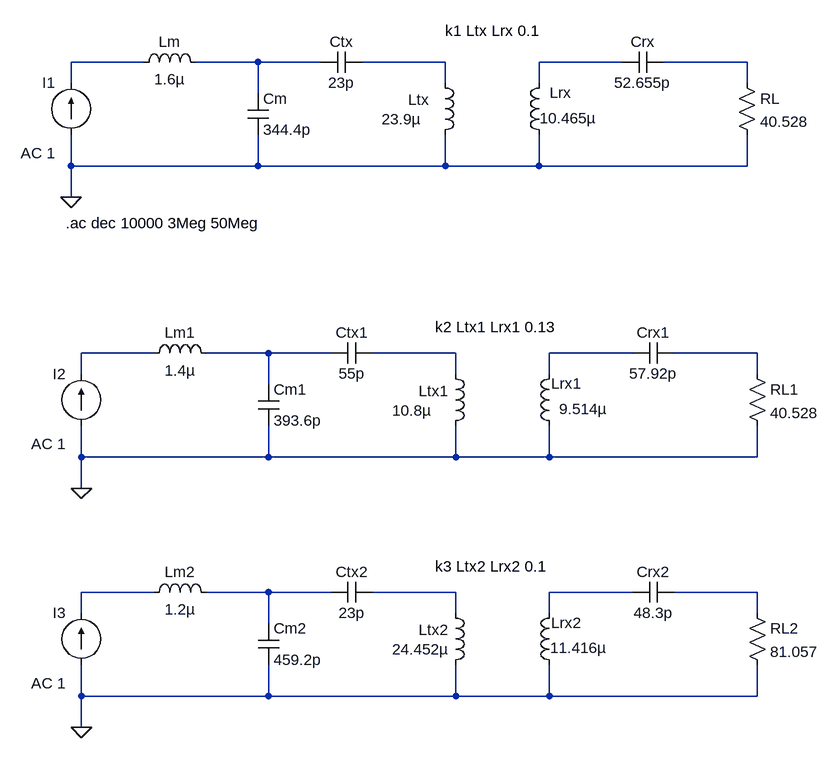
[diagram p0: schematic AC_LCCL_S.asc]
AC_LCCL_S.asc, the LTspice schematic file:
Version 4.1
SHEET 1 1048 1156
WIRE 0 112 -112 112
WIRE 176 112 80 112
WIRE 272 112 176 112
WIRE 464 112 336 112
WIRE 736 112 608 112
WIRE 928 112 800 112
WIRE -112 144 -112 112
WIRE 464 144 464 112
WIRE 608 144 608 112
WIRE 928 144 928 112
WIRE 176 160 176 112
WIRE -112 272 -112 224
WIRE 176 272 176 224
WIRE 176 272 -112 272
WIRE 464 272 464 224
WIRE 464 272 176 272
WIRE 608 272 608 224
WIRE 608 272 464 272
WIRE 928 272 928 224
WIRE 928 272 608 272
WIRE -112 320 -112 272
WIRE 16 560 -96 560
WIRE 192 560 96 560
WIRE 288 560 192 560
WIRE 480 560 352 560
WIRE 752 560 624 560
WIRE 944 560 816 560
WIRE -96 592 -96 560
WIRE 480 592 480 560
WIRE 624 592 624 560
WIRE 944 592 944 560
WIRE 192 608 192 560
WIRE -96 720 -96 672
WIRE 192 720 192 672
WIRE 192 720 -96 720
WIRE 480 720 480 672
WIRE 480 720 192 720
WIRE 624 720 624 672
WIRE 624 720 480 720
WIRE 944 720 944 672
WIRE 944 720 624 720
WIRE -96 768 -96 720
WIRE 16 928 -96 928
WIRE 192 928 96 928
WIRE 288 928 192 928
WIRE 480 928 352 928
WIRE 752 928 624 928
WIRE 944 928 816 928
WIRE -96 960 -96 928
WIRE 480 960 480 928
WIRE 624 960 624 928
WIRE 944 960 944 928
WIRE 192 976 192 928
WIRE -96 1088 -96 1040
WIRE 192 1088 192 1040
WIRE 192 1088 -96 1088
WIRE 480 1088 480 1040
WIRE 480 1088 192 1088
WIRE 624 1088 624 1040
WIRE 624 1088 480 1088
WIRE 944 1088 944 1040
WIRE 944 1088 624 1088
WIRE -96 1136 -96 1088
FLAG -112 320 0
FLAG -96 768 0
FLAG -96 1136 0
SYMBOL ind -16 128 R270
WINDOW 0 32 56 VTop 2
WINDOW 3 5 56 VBottom 2
SYMATTR InstName Lm
SYMATTR Value 1.6µ
SYMBOL cap 160 160 R0
SYMATTR InstName Cm
SYMATTR Value 344.4p
SYMBOL cap 336 96 R90
WINDOW 0 0 32 VBottom 2
WINDOW 3 32 32 VTop 2
SYMATTR InstName Ctx
SYMATTR Value 23p
SYMBOL ind 448 128 R0
WINDOW 0 -41 42 Left 2
WINDOW 3 -82 72 Left 2
SYMATTR InstName Ltx
SYMATTR Value 23.9µ
SYMATTR Type ind
SYMBOL ind 624 240 R180
WINDOW 0 -34 81 Left 2
WINDOW 3 -73 42 Left 2
SYMATTR InstName Lrx
SYMATTR Value 10.465µ
SYMATTR Type ind
SYMBOL cap 800 96 R90
WINDOW 0 0 32 VBottom 2
WINDOW 3 32 32 VTop 2
SYMATTR InstName Crx
SYMATTR Value 52.655p
SYMBOL res 912 128 R0
SYMATTR InstName RL
SYMATTR Value 40.528
SYMBOL current -112 224 R180
WINDOW 0 24 80 Left 2
WINDOW 3 24 0 Left 2
WINDOW 123 24 -28 Left 2
WINDOW 39 0 0 Left 0
SYMATTR InstName I1
SYMATTR Value ""
SYMATTR Value2 AC 1
SYMBOL ind 0 576 R270
WINDOW 0 32 56 VTop 2
WINDOW 3 5 56 VBottom 2
SYMATTR InstName Lm1
SYMATTR Value 1.4µ
SYMBOL cap 176 608 R0
SYMATTR InstName Cm1
SYMATTR Value 393.6p
SYMBOL cap 352 544 R90
WINDOW 0 0 32 VBottom 2
WINDOW 3 32 32 VTop 2
SYMATTR InstName Ctx1
SYMATTR Value 55p
SYMBOL ind 464 576 R0
WINDOW 0 -41 42 Left 2
WINDOW 3 -82 72 Left 2
SYMATTR InstName Ltx1
SYMATTR Value 10.8µ
SYMATTR Type ind
SYMBOL ind 640 688 R180
WINDOW 0 -34 81 Left 2
WINDOW 3 -73 42 Left 2
SYMATTR InstName Lrx1
SYMATTR Value 9.514µ
SYMATTR Type ind
SYMBOL cap 816 544 R90
WINDOW 0 0 32 VBottom 2
WINDOW 3 32 32 VTop 2
SYMATTR InstName Crx1
SYMATTR Value 57.92p
SYMBOL res 928 576 R0
SYMATTR InstName RL1
SYMATTR Value 40.528
SYMBOL current -96 672 R180
WINDOW 0 24 80 Left 2
WINDOW 3 24 0 Left 2
WINDOW 123 24 -28 Left 2
WINDOW 39 0 0 Left 0
SYMATTR InstName I2
SYMATTR Value ""
SYMATTR Value2 AC 1
SYMBOL ind 0 944 R270
WINDOW 0 32 56 VTop 2
WINDOW 3 5 56 VBottom 2
SYMATTR InstName Lm2
SYMATTR Value 1.2µ
SYMBOL cap 176 976 R0
SYMATTR InstName Cm2
SYMATTR Value 459.2p
SYMBOL cap 352 912 R90
WINDOW 0 0 32 VBottom 2
WINDOW 3 32 32 VTop 2
SYMATTR InstName Ctx2
SYMATTR Value 23p
SYMBOL ind 464 944 R0
WINDOW 0 -41 42 Left 2
WINDOW 3 -82 72 Left 2
SYMATTR InstName Ltx2
SYMATTR Value 24.452µ
SYMATTR Type ind
SYMBOL ind 640 1056 R180
WINDOW 0 -34 81 Left 2
WINDOW 3 -73 42 Left 2
SYMATTR InstName Lrx2
SYMATTR Value 11.416µ
SYMATTR Type ind
SYMBOL cap 816 912 R90
WINDOW 0 0 32 VBottom 2
WINDOW 3 32 32 VTop 2
SYMATTR InstName Crx2
SYMATTR Value 48.3p
SYMBOL res 928 944 R0
SYMATTR InstName RL2
SYMATTR Value 81.057
SYMBOL current -96 1040 R180
WINDOW 0 24 80 Left 2
WINDOW 3 24 0 Left 2
WINDOW 123 24 -28 Left 2
WINDOW 39 0 0 Left 0
SYMATTR InstName I3
SYMATTR Value ""
SYMATTR Value2 AC 1
TEXT 464 64 Left 2 !k1 Ltx Lrx 0.1
TEXT -120 360 Left 2 !.ac dec 10000 3Meg 50Meg
TEXT 448 520 Left 2 !k2 Ltx1 Lrx1 0.13
TEXT 448 888 Left 2 !k3 Ltx2 Lrx2 0.1

The netlist it stands for:
* AC_LCCL_S.asc
Lm N001 N002 1.6µ
Cm N002 0 344.4p
Ctx N003 N002 23p
Ltx N003 0 23.9µ
Lrx 0 N004 10.465µ
Crx N005 N004 52.655p
RL N005 0 40.528
I1 0 N001 AC 1
Lm1 N006 N007 1.4µ
Cm1 N007 0 393.6p
Ctx1 N008 N007 55p
Ltx1 N008 0 10.8µ
Lrx1 0 N009 9.514µ
Crx1 N010 N009 57.92p
RL1 N010 0 40.528
I2 0 N006 AC 1
Lm2 N011 N012 1.2µ
Cm2 N012 0 459.2p
Ctx2 N013 N012 23p
Ltx2 N013 0 24.452µ
Lrx2 0 N014 11.416µ
Crx2 N015 N014 48.3p
RL2 N015 0 81.057
I3 0 N011 AC 1
k1 Ltx Lrx 0.1
.ac dec 10000 3Meg 50Meg
k2 Ltx1 Lrx1 0.13
k3 Ltx2 Lrx2 0.1
.backanno
.end